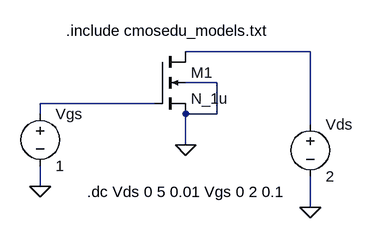
[diagram p0: schematic trab1.asc]
trab1.asc, the LTspice schematic file:
Version 4
SHEET 1 880 680
WIRE 448 80 256 80
WIRE 304 128 256 128
WIRE 208 160 32 160
WIRE 32 176 32 160
WIRE 304 176 304 128
WIRE 304 176 256 176
WIRE 448 192 448 80
WIRE 256 224 256 176
WIRE 32 288 32 256
WIRE 448 320 448 272
FLAG 32 288 0
FLAG 256 224 0
FLAG 448 320 0
SYMBOL nmos4 208 80 R0
SYMATTR InstName M1
SYMATTR Value N_1u
SYMATTR Value2 l=1.5u w=9.2u
SYMBOL voltage 32 160 R0
SYMATTR InstName Vgs
SYMATTR Value 1
SYMBOL voltage 448 176 R0
SYMATTR InstName Vds
SYMATTR Value 2
TEXT 104 296 Left 2 !.dc Vds 0 5 0.01 Vgs 0 2 0.1
TEXT 72 48 Left 2 !.include cmosedu_models.txt

The netlist it stands for:
* trab1.asc
M1 N001 N002 0 0 N_1u l=1.5u w=9.2u
Vgs N002 0 1
Vds N001 0 2
.model NMOS NMOS
.model PMOS PMOS
.lib standard.mos
.dc Vds 0 5 0.01 Vgs 0 2 0.1
.include cmosedu_models.txt
.backanno
.end